# EAGLE design ares2015_motor_v0 (EAGLE 6.5.0)
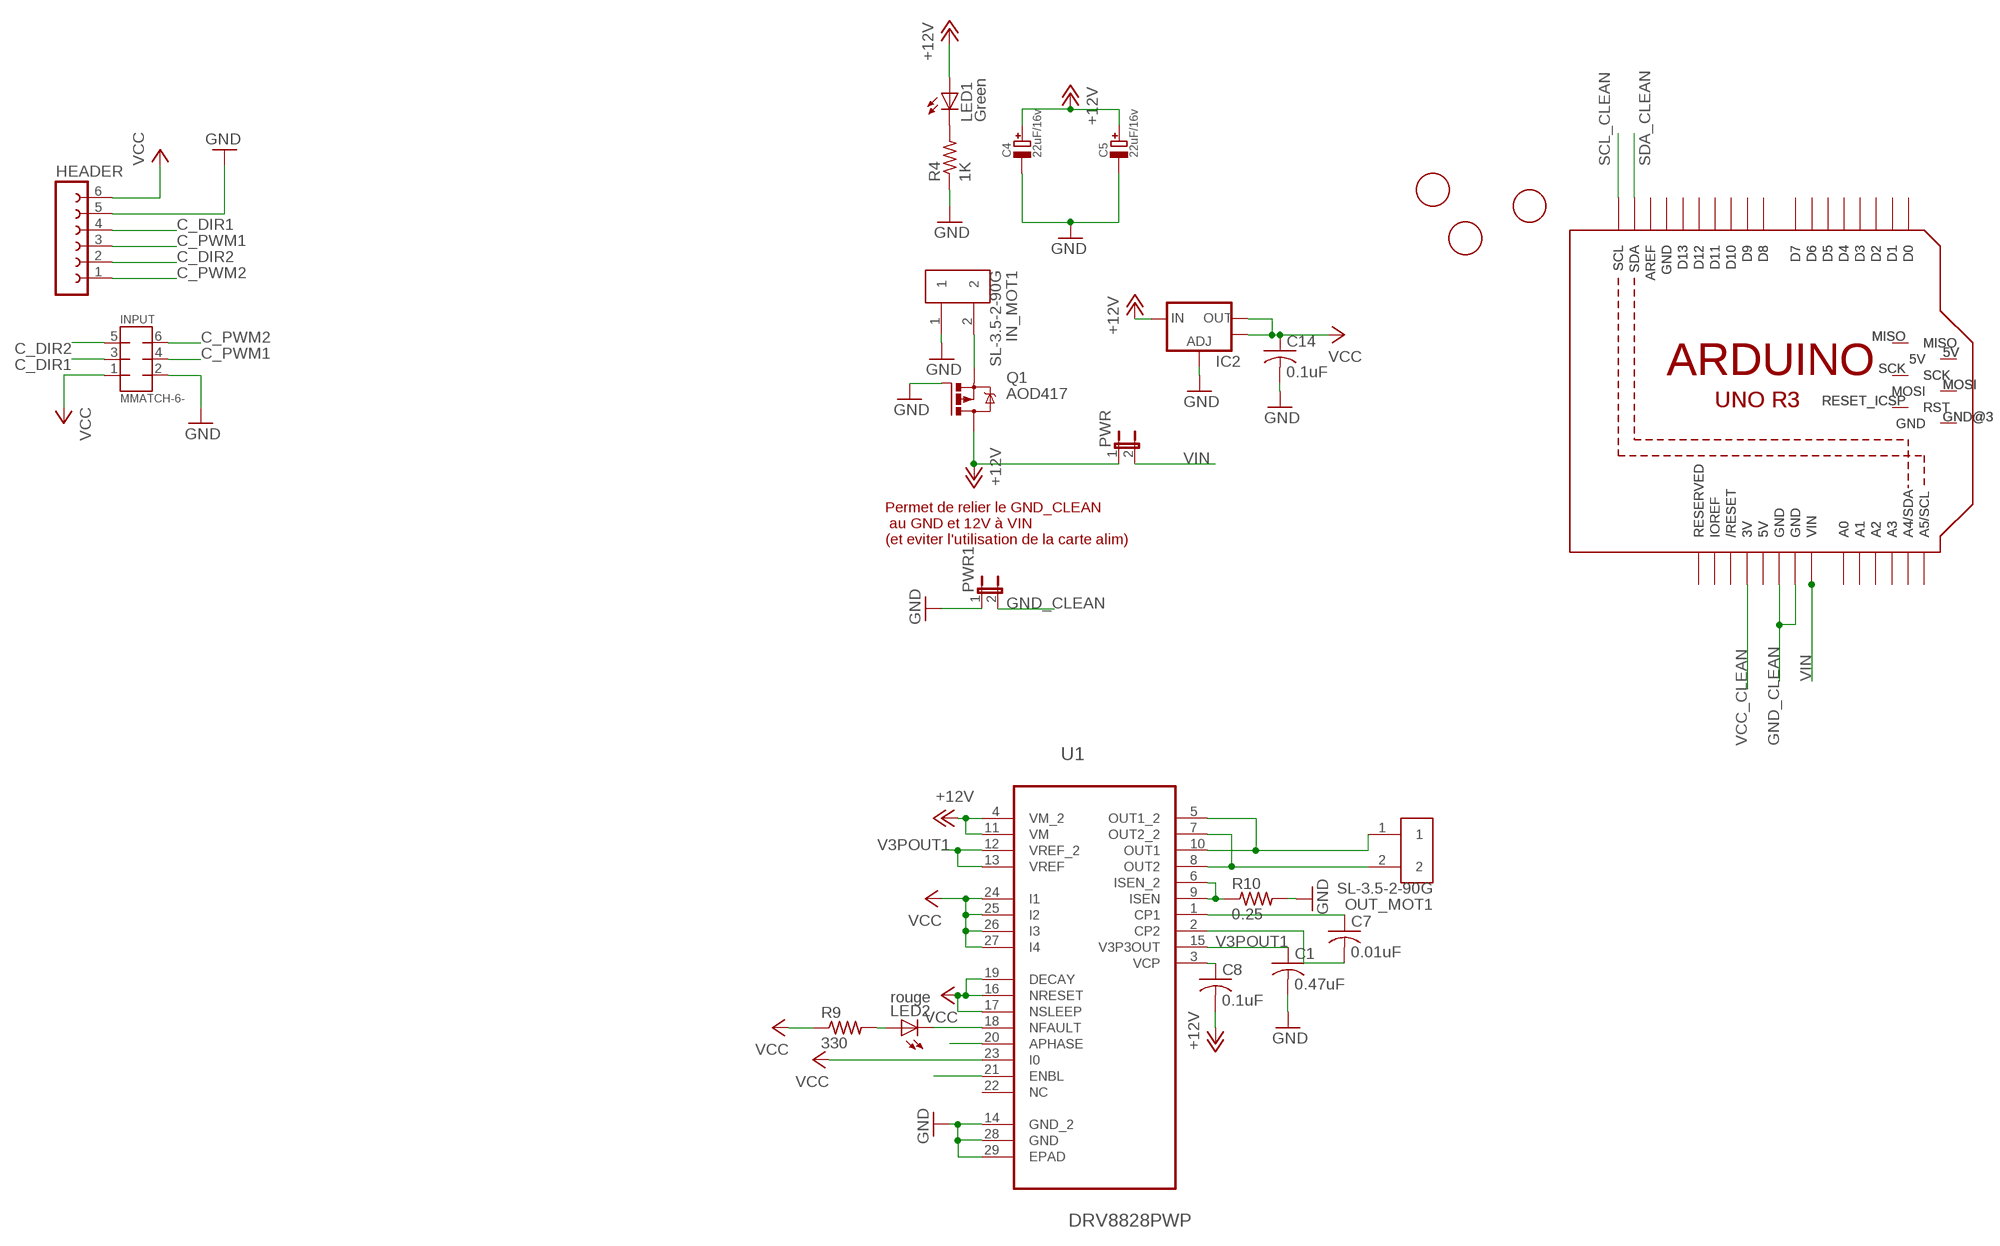
[diagram p0: schematic, sheet 1, part 1 of 2]
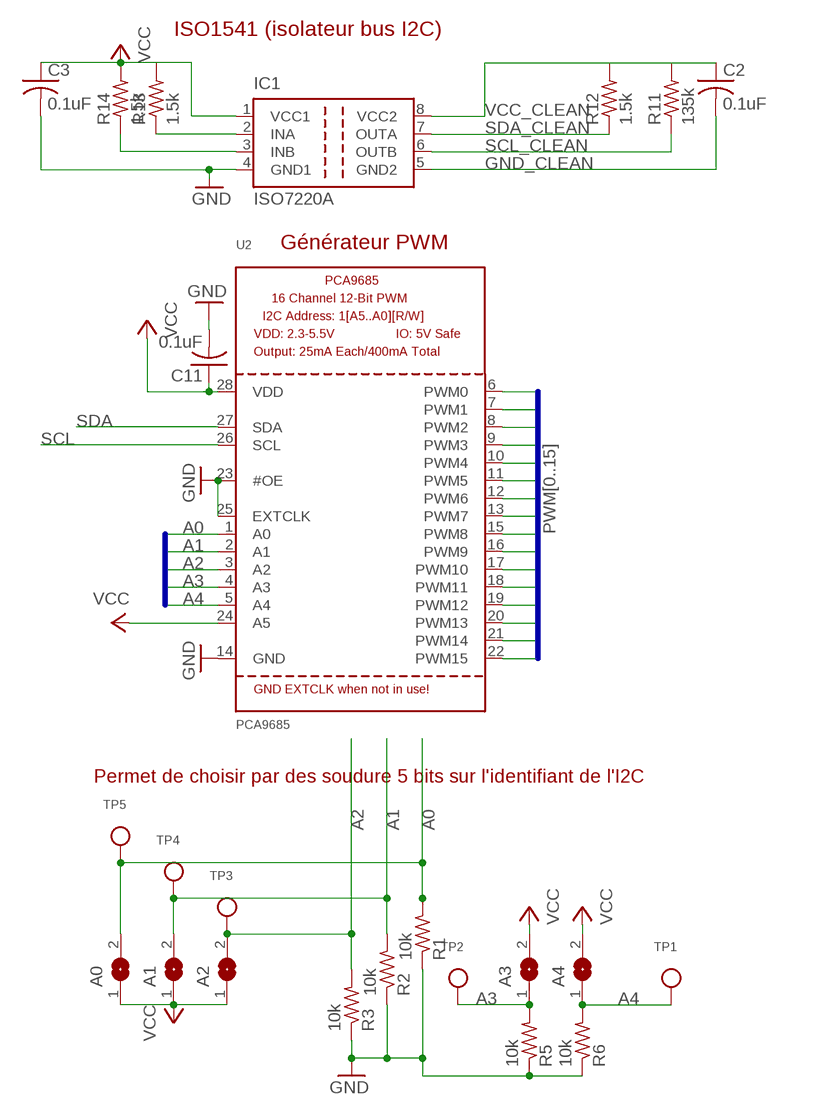
[diagram p1: schematic, sheet 1, part 2 of 2]

## Parts
A0  SJ  [SJ]
A1  SJ  [SJ]
A2  SJ  [SJ]
A3  SJ  [SJ]
A4  SJ  [SJ]
C1  0.47uF  C-USC0805K  [C0805K]
C2  0.1uF  C-USC0805K  [C0805K]
C3  0.1uF  C-USC0805K  [C0805K]
C4  22uF/16v  CAP_ELECTROLYTICPANASONIC_C  [PANASONIC_C]
C5  22uF/16v  CAP_ELECTROLYTICPANASONIC_C  [PANASONIC_C]
C7  0.01uF  C-USC0805K  [C0805K]
C8  0.1uF  C-USC0805K  [C0805K]
C11  0.1uF  C-USC0805K  [C0805K]
C14  0.1uF  C-USC0805K  [C0805K]
HEADER  FE06-1  [FE06]
IC1  ISO7220A  [SO-08]
IC2  V_REG_LM1117SOT223  [SOT223]
IN_MOT1  SL-3.5-2-90G  [SL-3.5-2-90G]
INPUT  MMATCH-6-  [AMP-215079-6]
LED1  Green  LEDCHIP-LED0805  [CHIP-LED0805]
LED2  rouge  LEDCHIPLED_0805  [CHIPLED_0805]
OUT_MOT1  SL-3.5-2-90G  [SL-3.5-2-90G]
PWR  JP1E  [JP1]
PWR1  JP1E  [JP1]
Q1  AOD417  IRFR5305  [D-PAK_TO252AA]
R1  10k  R-US_R0805  [R0805]
R2  10k  R-US_R0805  [R0805]
R3  10k  R-US_R0805  [R0805]
R4  1K  R-US_R0805  [R0805]
R5  10k  R-US_R0805  [R0805]
R6  10k  R-US_R0805  [R0805]
R9  330  R-US_R0805  [R0805]
R10  0.25  R-US_R0805  [R0805]
R11  135k  R-US_R0805  [R0805]
R12  1.5k  R-US_R0805  [R0805]
R13  1.5k  R-US_R0805  [R0805]
R14  1.5k  R-US_R0805  [R0805]
TP1  TESTPOINTROUND2MM  [TESTPOINT_ROUND_2MM]
TP2  TESTPOINTROUND2MM  [TESTPOINT_ROUND_2MM]
TP3  TESTPOINTROUND2MM  [TESTPOINT_ROUND_2MM]
TP4  TESTPOINTROUND2MM  [TESTPOINT_ROUND_2MM]
TP5  TESTPOINTROUND2MM  [TESTPOINT_ROUND_2MM]
U1  DRV8828PWP  [SOP65P640X120-29N]
U2  PCA9685  [TSSOP28]
U$1  ARDUINO_R3_ICSP  [ARDUINOR3_ICSP]
U$2  FIDUCIAL  [FIDUCIAL_1MM]
U$3  FIDUCIAL  [FIDUCIAL_1MM]
U$4  FIDUCIAL  [FIDUCIAL_1MM]
U$5  ARDUINO_R3_ICSP  [ARDUINOR3_ICSP]

## Nets
+12V: C4.+ C5.+ C8.2 IC2.3(IN) LED1.A PWR.1 Q1.4(D) U1.4(VM_2) U1.11(VM)
/RST: U$1.RESET(/RESET) U$5.RESET(/RESET)
A0: A0.2 R1.2 TP5.P$1 U2.1(A0)
A1: A1.2 R2.2 TP4.P$1 U2.2(A1)
A2: A2.2 R3.2 TP3.P$1 U2.3(A2)
A3: A3.1 R5.2 TP2.P$1 U2.4(A3)
A4: A4.1 R6.2 TP1.P$1 U2.5(A4)
C_DIR1: HEADER.4 INPUT.3
C_DIR2: HEADER.2 INPUT.5
C_PWM1: HEADER.3 INPUT.4
C_PWM2: HEADER.1 INPUT.6
GND: C1.2 C3.2 C4.- C5.- C11.2 C14.2 HEADER.5 IC1.4(GND1) IC2.1(ADJ) IN_MOT1.1 INPUT.2 PWR1.1 Q1.1(G) R1.1 R2.1 R3.1 R4.1 R5.1 R6.1 R10.2 U1.14(GND_2) U1.28(GND) U1.29(EPAD) U2.14(GND) U2.23(#OE) U2.25(EXTCLK)
GND_CLEAN: C2.2 IC1.5(GND2) PWR1.2 U$1.GND@1(GND) U$1.GND@2(GND) U$5.GND@1(GND) U$5.GND@2(GND)
N$1: U$1.IOREF U$5.IOREF
N$2: U$1.RESERVED U$5.RESERVED
N$3: U$1.MISO U$5.MISO
N$4: U$1.D9 U$5.D9
N$5: U$1.5V U$5.5V
N$6: U1.21(ENBL)
N$8: U$1.MOSI U$5.MOSI
N$9: U$1.5V_ICSP(5V) U$5.5V_ICSP(5V)
N$10: U$1.GND@3(GND) U$5.GND@3(GND)
N$11: U$1.SCK U$5.SCK
N$12: OUT_MOT1.2 U1.7(OUT2_2) U1.8(OUT2)
N$13: U$1.RESET_ICSP(RST) U$5.RESET_ICSP(RST)
N$14: OUT_MOT1.1 U1.5(OUT1_2) U1.10(OUT1)
N$15: U$1.A5(A5/SCL) U$5.A5(A5/SCL)
N$17: U$1.A4(A4/SDA) U$5.A4(A4/SDA)
N$18: IC1.2(INA) R13.1
N$19: IC1.3(INB) R14.1
N$20: U$1.A0 U$5.A0
N$21: U$1.A1 U$5.A1
N$22: U$1.A2 U$5.A2
N$23: U$1.A3 U$5.A3
N$24: U$1.D0 U$5.D0
N$25: U$1.D1 U$5.D1
N$26: U$1.D2 U$5.D2
N$27: U$1.D4 U$5.D4
N$28: U$1.D7 U$5.D7
N$29: U$1.D8 U$5.D8
N$30: U$1.D12 U$5.D12
N$31: U$1.D13 U$5.D13
N$32: U$1.AREF U$5.AREF
N$34: U$1.GND U$5.GND
N$35: R10.1 U1.6(ISEN_2) U1.9(ISEN)
N$36: C7.1 U1.1(CP1)
N$37: C7.2 U1.2(CP2)
N$39: C8.1 U1.3(VCP)
N$44: LED2.A R9.2
N$45: LED2.C U1.18(NFAULT)
N$49: U1.20(APHASE)
N$133: LED1.C R4.2
N$140: IN_MOT1.2 Q1.3(S)
PWM0: U2.6(PWM0)
PWM0A: U$1.D6 U$5.D6
PWM0B: U$1.D5 U$5.D5
PWM1: U2.7(PWM1)
PWM1B: U$1.D10 U$5.D10
PWM2: U2.8(PWM2)
PWM2A: U$1.D11 U$5.D11
PWM2B: U$1.D3 U$5.D3
PWM3: U2.9(PWM3)
PWM4: U2.10(PWM4)
PWM5: U2.11(PWM5)
PWM6: U2.12(PWM6)
PWM7: U2.13(PWM7)
PWM8: U2.15(PWM8)
PWM9: U2.16(PWM9)
PWM10: U2.17(PWM10)
PWM11: U2.18(PWM11)
PWM12: U2.19(PWM12)
PWM13: U2.20(PWM13)
PWM14: U2.21(PWM14)
PWM15: U2.22(PWM15)
SCL: U2.26(SCL)
SCL_CLEAN: IC1.6(OUTB) R11.1 U$1.SCL U$5.SCL
SDA: U2.27(SDA)
SDA_CLEAN: IC1.7(OUTA) R12.1 U$1.SDA U$5.SDA
V3POUT1: C1.1 U1.12(VREF_2) U1.13(VREF) U1.15(V3P3OUT)
VCC: A0.1 A1.1 A2.1 A3.2 A4.2 C3.1 C11.1 C14.1 HEADER.6 IC1.1(VCC1) IC2.2(OUT) IC2.4(OUT) INPUT.1 R9.1 U1.16(NRESET) U1.17(NSLEEP) U1.19(DECAY) U1.23(I0) U1.24(I1) U1.25(I2) U1.26(I3) U1.27(I4) U2.24(A5) U2.28(VDD)
VCC_CLEAN: C2.1 IC1.8(VCC2) R11.2 R12.2 U$1.3V U$5.3V
VIN: PWR.2 U$1.VIN U$5.VIN
Unconnected: R13.2 R14.2 U1.22(NC)

## Buses
PWM[0..15]
A[0..4]

## Notes on the sheet
- Permet de relier le GND_CLEAN
   au GND et 12V à VIN
  (et eviter l'utilisation de la carte alim)
- ISO1541 (isolateur bus I2C)
- Générateur PWM
- Permet de choisir par des soudure 5 bits sur l'identifiant de l'I2C

## Library data of the parts
A0 A1-A4 = jumper:SJ: SMD solder JUMPER
C1-C3 C7 C8 C11 C14 = adafruit:C-US: CAPACITOR, American symbol
C4 C5 = microbuilder:CAP_ELECTROLYTIC: Electrolytic Capacitors SMT PANASONIC_C - Size C Panasonic Electrolytic Aluminum Capacitor 47µF 16V 20% Electrolytic Capacitor [Digikey: PCE3890TR-ND] PANASONIC_D - Size D Panasonic Electrolytic Aluminum Capacitor 100µF 25V 20% Electrolytic Capacitor [Digikey: PCE3898TR-ND] PTH 3.5 mm grid, 8 mm diameter ... 3.5 mm grid, 10 mm diameter ...
HEADER = con-lsta:FE06-1: FEMALE HEADER; OC_FARNELL: unknown; OC_NEWARK: unknown
IC1 = texas:ISO7220: DUAL DIGITAL ISOLATORS Source: http://focus.ti.com/lit/ds/symlink/iso7221a.pdf; MPN: ISO7220AD; OC_FARNELL: 1390649; OC_NEWARK: 48M0666
IC2 = SparkFun-PowerIC:V_REG_LM1117: Voltage Regulator LM1117 Standard adjustable voltage regulator but in SMD form. Spark Fun Electronics SKU : COM-00595
IN_MOT1 OUT_MOT1 = WEIDMULLER:SL-3.5-2-90G
INPUT = jt-con-micromatch:MMATCH-6-*
LED1 LED2 = adafruit:LED: LED OSRAM: - CHIPLED LG R971, LG N971, LY N971, LG Q971, LY Q971, LO R971, LY R971 LH N974, LH R974 LS Q976, LO Q976, LY Q976 LO Q996 - Hyper CHIPLED LW Q18S LB Q993, LB Q99A, LB R99A - SideLED LS A670, LO A670, LY A670, LG A670, LP A670 LB A673, LV A673, LT A673, LW A673 LH A674 LY A675 LS A676, LA A676, LO A676, LY A676, LW A676 LS A679, LY A679, LG A679 - Hyper Micro SIDELED® LS Y876, LA Y876, LO Y876, LY Y876 LT Y87S - SmartLED LW L88C, LW L88S LB L89C, LB L89S, LG L890 LS L89K, LO L89K, LY L89K LS L896, LA L896, LO L896, LY L896 - TOPLED LS T670, LO T670, LY T670, LG T670, LP T670 LSG T670, LSP T670, LSY T670, LOP T670, LYG T670 LG T671, LOG T671, LSG T671 LB T673, LV T673, LT T673, LW T673 LH T674 LS T676, LA T676, LO T676, LY T676, LB T676, LH T676, LSB T676, LW T676 LB T67C, LV T67C, LT T67C, LS T67K, LO T67K, LY T67K, LW E67C LS E67B, LA E67B, LO E67B, LY E67B, LB E67C, LV E67C, LT E67C LW T67C LS T679, LY T679, LG T679 LS T770, LO T770, LY T770, LG T770, LP T770 LB T773, LV T773, LT T773, LW T773 LH T774 LS E675, LA E675, LY E675, LS T675 LS T776, LA T776, LO T776, LY T776, LB T776 LHGB T686 LT T68C, LB T68C - Hyper Mini TOPLED® LB M676 - Mini TOPLED Santana® LG M470 LS M47K, LO M47K, LY M47K Source: http://www.osram.convergy.de/
PWR PWR1 = jumper:JP1E: JUMPER
Q1 = transistor-power:IRF?5305: HEXFET Power MOSFET Source: http://www.irf.com/product-info/datasheets/data/irfr5305pbf.pdf
R1-R6 R9-R14 = adafruit:R-US_: RESISTOR, American symbol
TP1-TP5 = microbuilder:TESTPOINT: Test Point Various test points for characterisation and PCB testing TESTPOINT_SMT - Compact Surface Mount Test Point [Digikey: 5016KTR-ND]
U1 = Texas Instruments_By_element14_Batch_1:DRV8828PWP: H-BRIDGE MOTOR CONTROLLER IC; MPN: DRV8828PWP; OC_FARNELL: -; OC_NEWARK: 79R7959; PACKAGE: TSSOP-28; SUPPLIER: Texas Instruments
U2 = microbuilder:PCA9685: PCA9685 - 16 Channel 12-Bit I2C PWM Controller 5.0V tolerant 16 channel, 12-bit I2C PWM controller with 25mA per output (max. 400mA total) Digikey: 568-5931-1-ND
U$1 U$5 = adafruit:ARDUINO_R3_ICSP
U$2-U$4 = adafruit:FIDUCIAL: For use by pick and place machines to calibrate the vision/machine, 1mm By microbuilder.eu

## Board
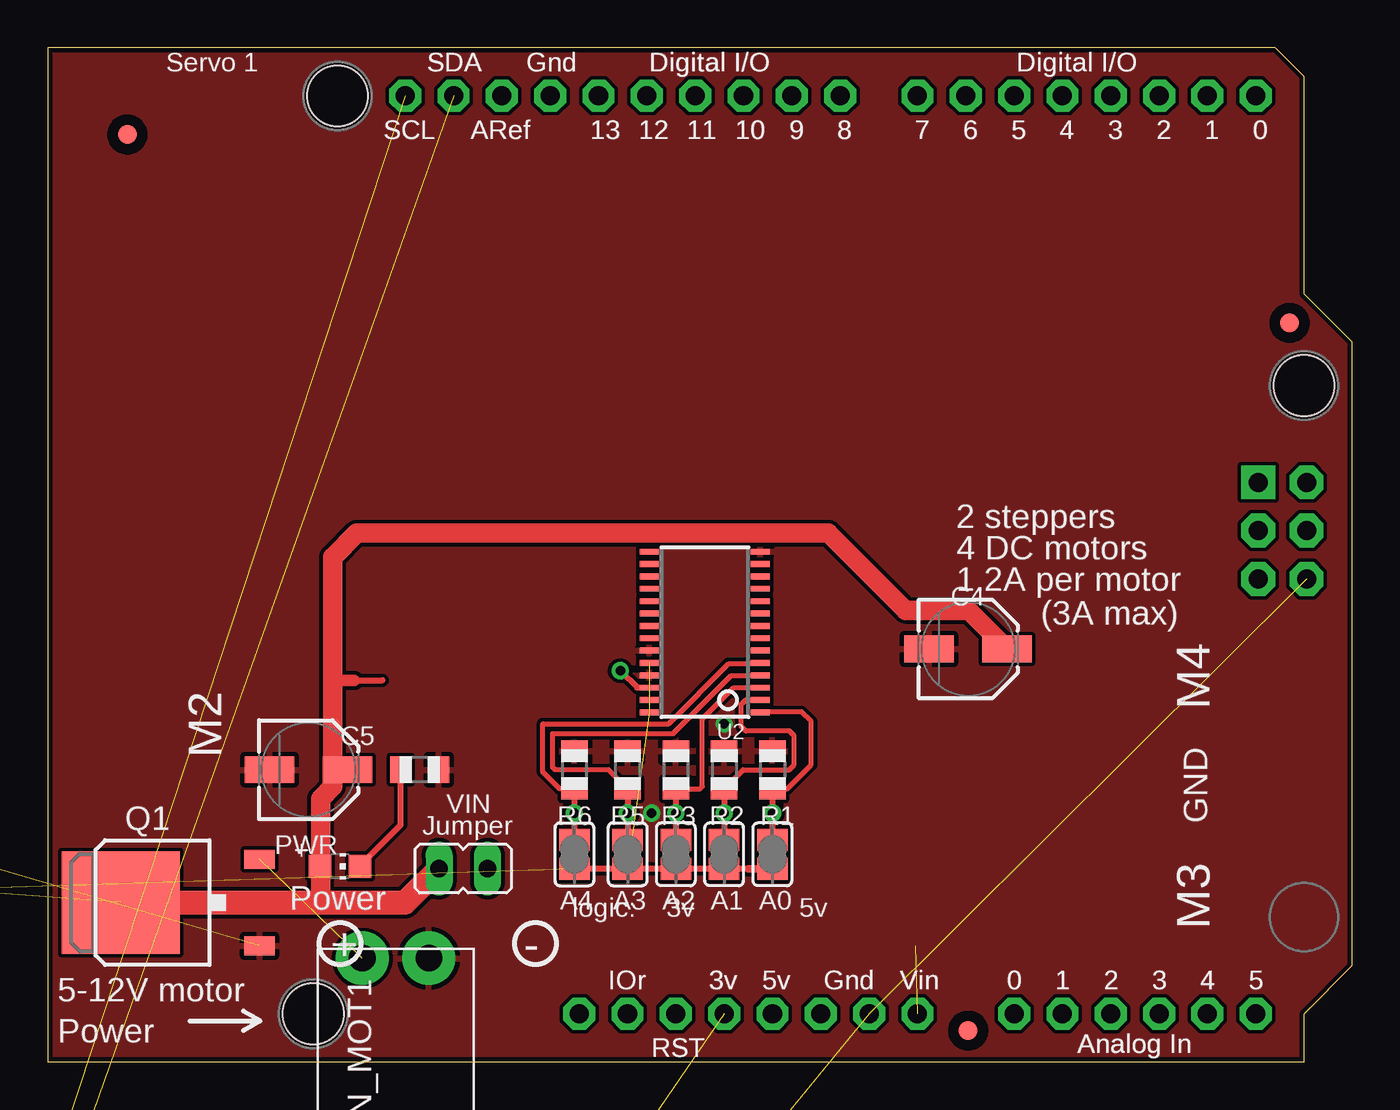
[diagram p2: board, top side]
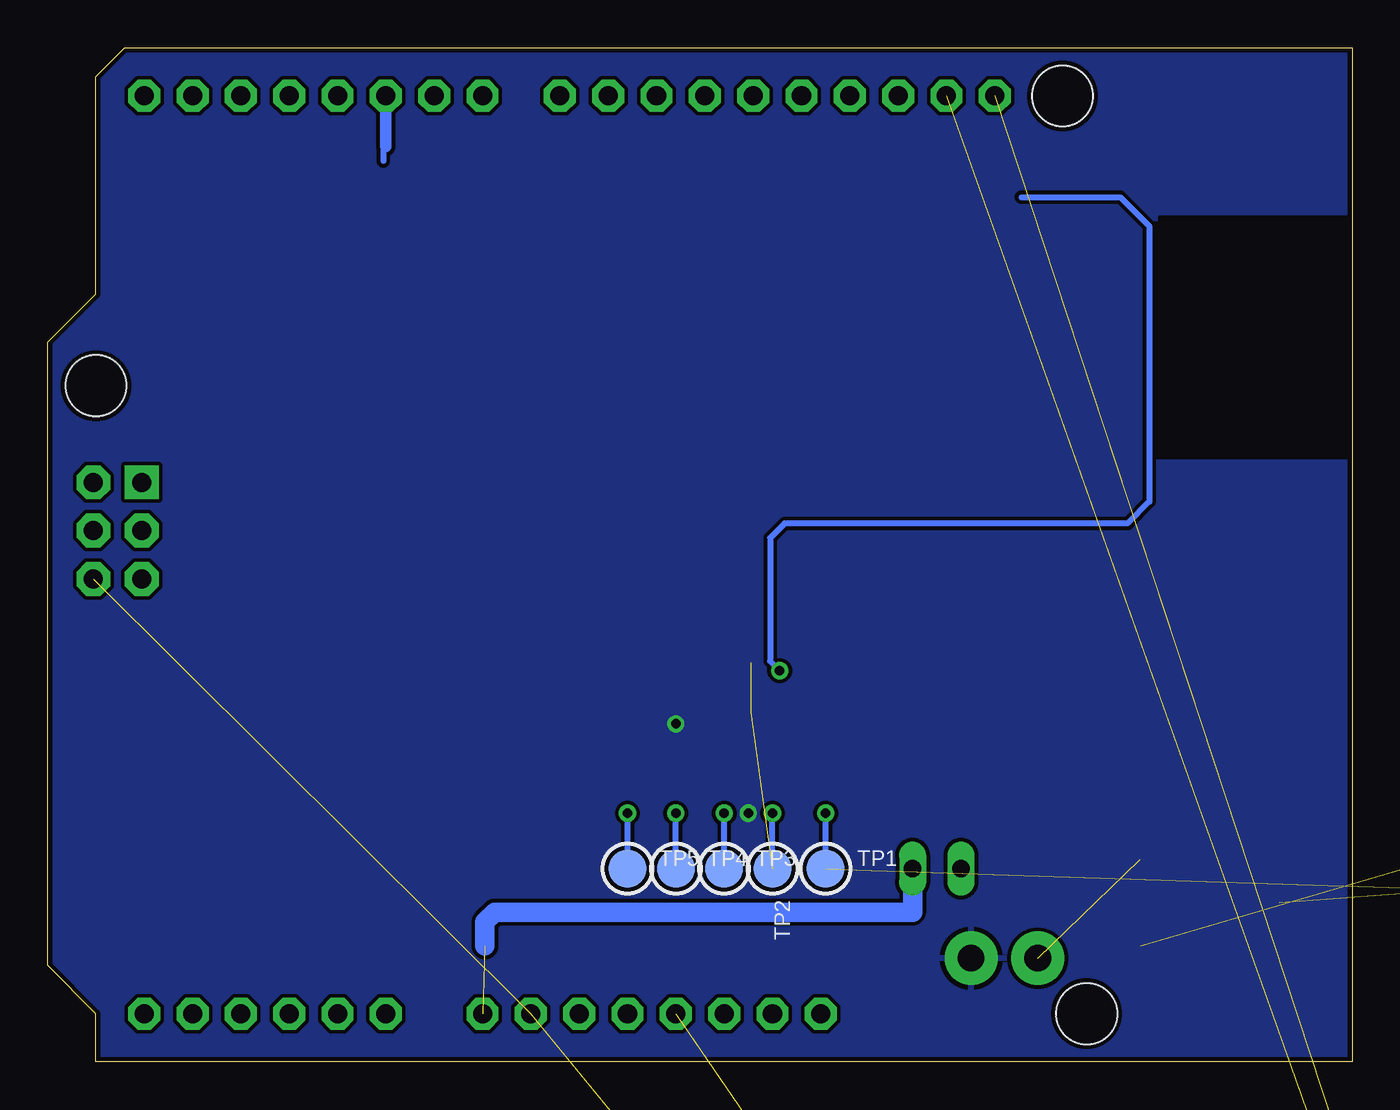
[diagram p3: board, bottom side, seen from below]

Size 68.58 x 53.34 mm. Coordinates in mm from the lower left corner, seen from the top.
Copper layers (1*16): Top 0.035mm / dielectric 1.5mm / Bottom 0.035mm
Design rules "pcbcart *": minimum track width 10mil, minimum drill 16mil, track to track 8mil, track to pad 8mil, pad to pad 8mil, via to via 8mil, smd to smd 8mil, copper to edge 10mil, drill to drill 8mil, minimum pad ring 10mil, minimum via ring 8mil, stop-mask expansion 4mil, vias tented up to drill 20mil, thermal gap 10mil
Holes 3.2 mm at 15.24,50.8 66.04,35.56 13.97,2.54

### Footprints (pad centres in the part's own frame; a part is rotated, then mirrored left to right if it is on the bottom)
SJ = smd 1.168 x 1.6: 1 -0.762,0; 2 0.762,0
C0805K = smd 1.1 x 1.4: 1 -1,0; 2 1,0
PANASONIC_C = smd 2.6 x 1.4: + 2.05,0; - -2.05,0
FE06 = drill 0.813 long: 1 -6.35,0; 2 -3.81,0; 3 -1.27,0; 4 1.27,0; 5 3.81,0; 6 6.35,0
SO-08 = smd 0.6 x 2.2: 1 -1.905,-2.6; 2 -0.635,-2.6; 3 0.635,-2.6; 4 1.905,-2.6; 5 1.905,2.6; 6 0.635,2.6; 7 -0.635,2.6; 8 -1.905,2.6
SOT223 = smd 1.219 x 2.235: 1 -2.311,-3.099; 2 0,-3.099; 3 2.311,-3.099 | smd 3.6 x 2.2: 4 0,3.099
SL-3.5-2-90G = drill 1.4 pad 2.8: 1 0,-1.75; 2 0,1.75
AMP-215079-6 = drill 0.8 pad 1.422: 1 0,0; 2 1.27,2.54; 3 2.54,0; 4 3.81,2.54; 5 5.08,0; 6 6.35,2.54 | hole 1.5: -1.62,2.175
CHIP-LED0805 = smd 1.2 x 1.2: A 0,-1.05; C 0,1.05
CHIPLED_0805 = smd 1.2 x 1.2: A 0,-1.05; C 0,1.05
JP1 = drill 0.914 long: 1 0,-1.27; 2 0,1.27
D-PAK_TO252AA = smd 1 x 1.6: 1 -2.28,-4.8; 3 2.28,-4.8 | smd 5.4 x 6.2: 4 0,2.5
R0805 = smd 1.1 x 1.4: 1 -1,0; 2 1,0
TESTPOINT_ROUND_2MM = smd 2 x 2: P$1 0,0
SOP65P640X120-29N = smd 1.473 x 0.356: 1 -2.921,4.216; 2 -2.921,3.581; 3 -2.921,2.921; 4 -2.921,2.286; 5 -2.921,1.626; 6 -2.921,0.965; 7 -2.921,0.33; 8 -2.921,-0.33; 9 -2.921,-0.965; 10 -2.921,-1.626; 11 -2.921,-2.286; 12 -2.921,-2.921; 13 -2.921,-3.581; 14 -2.921,-4.216; 15 2.921,-4.216; 16 2.921,-3.581; 17 2.921,-2.921; 18 2.921,-2.286; 19 2.921,-1.626; 20 2.921,-0.965; 21 2.921,-0.33; 22 2.921,0.33; 23 2.921,0.965; 24 2.921,1.626; 25 2.921,2.286; 26 2.921,2.921; 27 2.921,3.581; 28 2.921,4.216 | smd 2.388 x 6.172: 29 0,0
TSSOP28 = smd 0.305 x 0.991: 1 -4.225,-2.918; 2 -3.575,-2.918; 3 -2.925,-2.918; 4 -2.275,-2.918; 5 -1.625,-2.918; 6 -0.975,-2.918; 7 -0.325,-2.918; 8 0.325,-2.918; 9 0.975,-2.918; 10 1.625,-2.918; 11 2.275,-2.918; 12 2.925,-2.918; 13 3.575,-2.918; 14 4.225,-2.918; 15 4.225,2.918; 16 3.575,2.918; 17 2.925,2.918; 18 2.275,2.918; 19 1.625,2.918; 20 0.975,2.918; 21 0.325,2.918; 22 -0.325,2.918; 23 -0.975,2.918; 24 -1.625,2.918; 25 -2.275,2.918; 26 -2.925,2.918; 27 -3.575,2.918; 28 -4.225,2.918
ARDUINOR3_ICSP = drill 1 pad 1.676 octagon: 3V 35.56,2.54; 5V 38.1,2.54; A0 50.8,2.54; A1 53.34,2.54; A2 55.88,2.54; A3 58.42,2.54; A4 60.96,2.54; A5 63.5,2.54; AREF 23.876,50.8; D0 63.5,50.8; D1 60.96,50.8; D2 58.42,50.8; D3 55.88,50.8; D4 53.34,50.8; D5 50.8,50.8; D6 48.26,50.8; D7 45.72,50.8; D8 41.656,50.8; D9 39.116,50.8; D10 36.576,50.8; D11 34.036,50.8; D12 31.496,50.8; D13 28.956,50.8; GND 26.416,50.8; GND@2 43.18,2.54; GND@3 40.64,2.54; IOREF 30.48,2.54; RESERVED 27.94,2.54; RESET 33.02,2.54; SCL 18.796,50.8; SDA 21.336,50.8; VIN 45.72,2.54 | drill 1 pad 1.778 octagon: 5V_ICSP 66.167,30.48; GND@1 66.167,25.4; MOSI 66.167,27.94; RESET_ICSP 63.627,25.4; SCK 63.627,27.94 | drill 1 pad 1.778 square: MISO 63.627,30.48
FIDUCIAL_1MM = smd 1 x 1: 1 0,0

### Placement (x,y rotation side)
A0  38.1,10.92 90 top
A1  35.56,10.92 90 top
A2  33.02,10.92 90 top
A3  30.48,10.92 270 top
A4  27.69,10.92 270 top
C1  -26.16,-90.93 0 top  (outside the outline)
C2  -33.02,-116.33 0 top  (outside the outline)
C3  -33.02,-132.21 0 top  (outside the outline)
C4  48.39,21.72 0 top
C5  13.72,15.37 0 top
C7  -19.43,-14.48 0 top  (outside the outline)
C8  -19.43,-19.18 0 top  (outside the outline)
C11  -26.16,-86.23 0 top  (outside the outline)
C14  -26.16,-81.53 0 top  (outside the outline)
HEADER  -13.72,-42.55 0 top  (outside the outline)
IC1  -30.23,-98.93 0 top  (outside the outline)
IC2  -24.89,-74.93 0 top  (outside the outline)
IN_MOT1  18.29,5.46 90 top
INPUT  -18.8,-35.94 0 top  (outside the outline)
LED1  15.37,10.29 270 top
LED2  -18.54,0.76 0 top  (outside the outline)
OUT_MOT1  -10.92,-25.78 0 top  (outside the outline)
PWR  21.84,10.16 270 top
PWR1  -31.75,-90.17 0 top  (outside the outline)
Q1  6.35,8.38 90 top
R1  38.1,15.37 270 top
R2  35.56,15.37 270 top
R3  33.02,15.37 270 top
R4  19.56,15.37 180 top
R5  30.48,15.37 270 top
R6  27.69,15.37 270 top
R9  -19.43,-3.81 0 top  (outside the outline)
R10  -19.43,-9.4 0 top  (outside the outline)
R11  -33.02,-105.66 0 top  (outside the outline)
R12  -33.02,-111.25 0 top  (outside the outline)
R13  -33.02,-121.54 0 top  (outside the outline)
R14  -33.02,-127.13 0 top  (outside the outline)
TP1  27.69,10.16 0 bottom
TP2  30.48,10.16 270 bottom
TP3  33.02,10.16 0 bottom
TP4  35.56,10.16 0 bottom
TP5  38.1,10.16 0 bottom
U1  -10.41,7.37 0 top  (outside the outline)
U2  34.54,22.61 90 top
U$1  0,0 0 top
U$2  48.39,1.65 0 top
U$3  4.19,48.77 0 top
U$4  65.28,38.86 0 top
U$5  0,0 0 top

### Tracks (layer width: path | path; a pad name or v marks a point on that pad's centre or on a via)
+12V  (4 unrouted)
  Top 0.305: 16.13,20.07 17.59,20.07 | 14.99,15.88 14.73,15.62 14.99,15.37 C5.+ | 14.99,26.54 15.01,26.56
  Top 0.61: 14.99,20.07 16.13,20.07
  Top 1.016: 14.99,26.54 14.99,20.07 14.99,15.88 14.99,14.48 14.35,13.84 14.35,10.29 LED1.A 14.35,10.25 14.35,8.38 | 15.01,26.56 16.26,27.81 41.04,27.81 45.1,23.75 48.41,23.75 C4.+
  Top 1.27: Q1.4 14.35,8.38 18.8,8.38 PWR.1
A0  (via drill 0.5)
  Top 0.254: R1.2 38.88,14.37 40.13,15.62 40.13,17.91 39.62,18.41 37.75,18.41 U2.1
  Top 0.305: R1.2 v38.1,13.08 A0.2
  Bottom 0.305: TP5.P$1 v38.1,13.08
A1  (via drill 0.5)
  Top 0.254: R2.2 36.56,15.37 38.99,15.37 39.24,15.62 39.24,17.14 38.99,17.4 36.7,17.4 36.45,17.65 36.45,18.8 36.7,19.05 37.7,19.05 U2.2
  Top 0.305: R2.2 v35.56,13.08 A1.2
  Bottom 0.305: TP4.P$1 v35.56,13.08
A2  (via drill 0.5)
  Top 0.254: R3.2 34.31,14.37 34.42,14.48 34.42,18.03 36.06,19.68 U2.3
  Top 0.305: R3.2 v33.02,13.08 A2.2
  Bottom 0.305: TP3.P$1 v33.02,13.08
A3  (via drill 0.5)
  Top 0.254: R5.2 29.48,15.37 26.67,15.37 26.54,15.49 26.54,17.27 32.89,17.27 35.94,20.32 37.7,20.32 U2.4
  Top 0.305: R5.2 v30.48,13.08 A3.1
  Bottom 0.305: TP2.P$1 v30.48,13.08
A4  (via drill 0.5)
  Top 0.254: R6.2 26.91,14.37 26.04,15.24 26.04,17.78 32.64,17.78 35.81,20.95 37.69,20.95 U2.5
  Top 0.305: R6.2 v27.69,13.08 A4.1
  Bottom 0.305: TP1.P$1 v27.69,13.08
C_DIR1  (1 unrouted)
C_DIR2  (1 unrouted)
C_PWM1  (1 unrouted)
C_PWM2  (1 unrouted)
GND  (via drill 0.5)  (13 unrouted)
  other vias: 35.56,17.78 31.75,13.08
  pour Bottom: 0,0.13 0,53.72 71.25,53.59 71.25,0
  pour Top: 0,0.13 0,53.72 70.74,53.72 70.74,0.13
GND_CLEAN  (4 unrouted)
N$12  (2 unrouted)
N$14  (2 unrouted)
N$18  (1 unrouted)
N$19  (1 unrouted)
N$35  (2 unrouted)
N$36  (1 unrouted)
N$37  (1 unrouted)
N$39  (1 unrouted)
N$44  (1 unrouted)
N$45  (1 unrouted)
N$133
  Top 0.305: LED1.C 16.38,10.29 18.56,12.46 R4.2
N$140  (1 unrouted)
PWM0B
  Bottom 0.305: 50.8,48.13 50.93,48.01 50.93,47.37
  Bottom 0.61: U$5.D5 50.8,48.13
SCL  (via drill 0.5)
  Top 0.305: v30.1,20.57 30.99,19.68 U2.26
  Bottom 0.305: 17.4,45.47 12.19,45.47 10.67,43.94 10.67,29.46 11.81,28.32 29.84,28.32 30.61,27.56 30.61,21.08 v30.1,20.57
SCL_CLEAN  (2 unrouted)
SDA
  Top 0.305: 31.9,19.05 U2.27
SDA_CLEAN  (2 unrouted)
V3POUT1  (3 unrouted)
VCC  (19 unrouted)
  Top 0.305: A0.1 A1.1 A2.1 A3.2 A4.2
  Top 0.406: 36.83,10.16 A0.1
VCC_CLEAN  (4 unrouted)
VIN  (1 unrouted)
  Bottom 1.016: PWR.2 23.11,7.87 45.09,7.87 45.59,7.37 45.59,6.1

### Text on the board
tPlace: Servo 1 | 2 steppers | 4 DC motors | 1.2A per motor | (3A max) | M4 | M2 | VIN | GND | Jumper | Power | logic: | 3v | 5v | M3 | + | - | 5-12V motor | Power